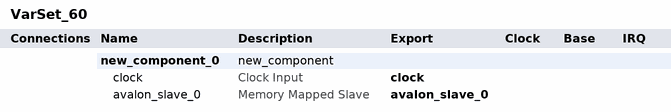
[diagram p0: system contents]
# Platform Designer (Qsys) system VarSet_60, Cyclone IV E EP4CE30F23I7
# Parameters at their usual value, and those the tool derives, are not listed.
package require qsys
create_system VarSet_60
set_project_property DEVICE_FAMILY {Cyclone IV E}
set_project_property DEVICE EP4CE30F23I7

add_instance new_component_0 new_component 1.0
set_instance_property new_component_0 AUTO_EXPORT true

# exported interfaces
add_interface avalon_slave_0 avalon slave
set_interface_property avalon_slave_0 EXPORT_OF new_component_0.avalon_slave_0
add_interface clock clock sink
set_interface_property clock EXPORT_OF new_component_0.clock

set_interconnect_requirement {$system} qsys_mm.clockCrossingAdapter HANDSHAKE
set_interconnect_requirement {$system} qsys_mm.enableEccProtection FALSE
set_interconnect_requirement {$system} qsys_mm.insertDefaultSlave FALSE
set_interconnect_requirement {$system} qsys_mm.maxAdditionalLatency 1

save_system VarSet_60.qsys
